# EAGLE design H41R60 (EAGLE 9.2.2)
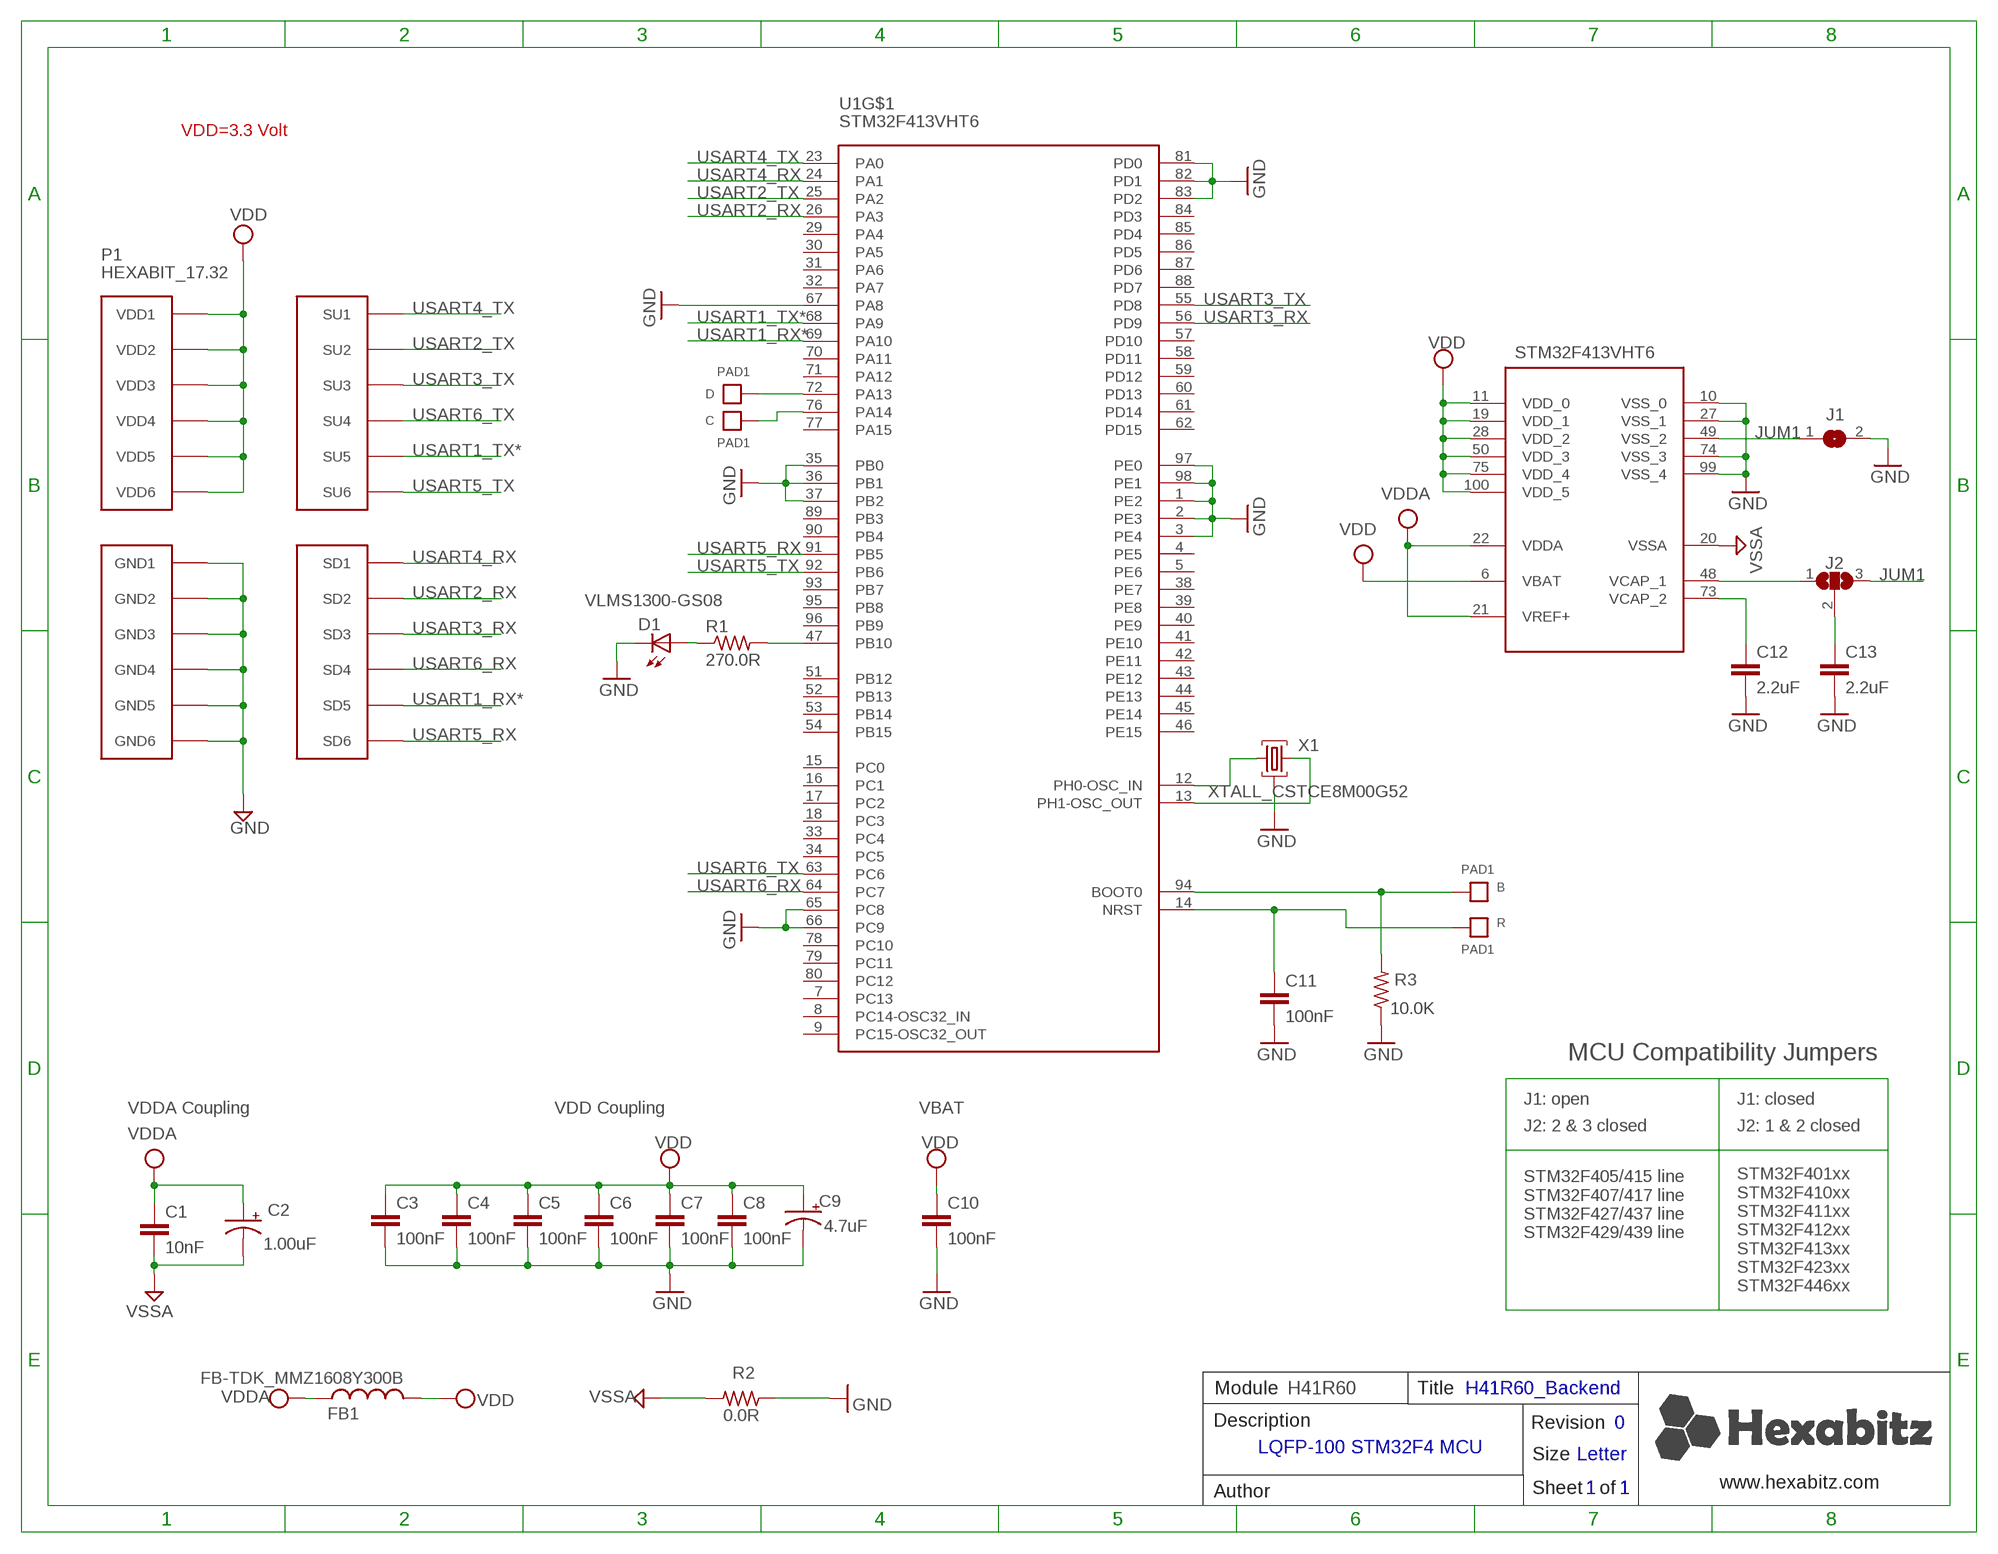
[diagram p0: schematic, sheet 1]

## Parts
B  PAD1  [PAD1]
C  PAD1  [PAD1]
C1  10nF  C-0603  [C-0603]
C2  1.00uF  C-0805-POL  [C-0805-POL]
C3  100nF  C-0603  [C-0603]
C4  100nF  C-0603  [C-0603]
C5  100nF  C-0603  [C-0603]
C6  100nF  C-0603  [C-0603]
C7  100nF  C-0603  [C-0603]
C8  100nF  C-0603  [C-0603]
C9  4.7uF  C-0805-POL  [C-0805-POL]
C10  100nF  C-0603  [C-0603]
C11  100nF  C-0603  [C-0603]
C12  2.2uF  C-0603  [C-0603]
C13  2.2uF  C-0603  [C-0603]
D  PAD1  [PAD1]
D1  VLMS1300-GS08  [VLMS1300-GS08]
FB1  FB-TDK_MMZ1608Y300B  [FB-TDK_MMZ1608Y300B]
J1  SJ  [SJ]
J2  SJ2W  [SJ_2]
P1  HEXABIT_17.32  [HEXABIT_17.32]
R  PAD1  [PAD1]
R1  270.0R  R-0603  [R-0603]
R2  0.0R  R-0603  [R-0603]
R3  10.0K  R-0603  [R-0603]
U1  STM32F413VHT6  [LQFP-100]
X1  XTALL_CSTCE8M00G52  [XTALL_CSTCE8M00G52]

## Nets
B1: B.P$1 B.P$2 R3.2 U1.94(BOOT0)
GND: C3.2 C4.2 C5.2 C6.2 C7.2 C8.2 C9.2(-) C10.2 C11.2 C12.2 C13.2 D1.C J1.2 P1.PAD_PD7(GND1) P1.PAD_PD8(GND2) P1.PAD_PD9(GND3) P1.PAD_PD10(GND4) P1.PAD_PD11(GND5) P1.PAD_PD12(GND6) R2.1 R3.1 U1.1(PE2) U1.2(PE3) U1.3(PE4) U1.10(VSS_0) U1.27(VSS_1) U1.35(PB0) U1.36(PB1) U1.37(PB2) U1.65(PC8) U1.66(PC9) U1.67(PA8) U1.74(VSS_3) U1.81(PD0) U1.82(PD1) U1.83(PD2) U1.97(PE0) U1.98(PE1) U1.99(VSS_4) X1.P$2
JUM1: J1.1 J2.3 U1.49(VSS_2)
N$1: D.P$1 D.P$2 U1.72(PA13)
N$2: C.P$1 C.P$2 U1.76(PA14)
N$3: U1.12(PH0-OSC_IN) X1.P$1
N$4: U1.13(PH1-OSC_OUT) X1.P$3
N$5: C12.1 U1.73(VCAP_2)
N$6: C13.1 J2.2
N$7: R1.2 U1.47(PB10)
N$8: D1.A R1.1
N$9: J2.1 U1.48(VCAP_1)
R1: C11.1 R.P$1 R.P$2 U1.14(NRST)
USART1_RX*: P1.PAD_PD5(SD5) U1.69(PA10)
USART1_TX*: P1.PAD_PU5(SU5) U1.68(PA9)
USART2_RX: P1.PAD_PD2(SD2) U1.26(PA3)
USART2_TX: P1.PAD_PU2(SU2) U1.25(PA2)
USART3_RX: P1.PAD_PD3(SD3) U1.56(PD9)
USART3_TX: P1.PAD_PU3(SU3) U1.55(PD8)
USART4_RX: P1.PAD_PD1(SD1) U1.24(PA1)
USART4_TX: P1.PAD_PU1(SU1) U1.23(PA0)
USART5_RX: P1.PAD_PD6(SD6) U1.91(PB5)
USART5_TX: P1.PAD_PU6(SU6) U1.92(PB6)
USART6_RX: P1.PAD_PD4(SD4) U1.64(PC7)
USART6_TX: P1.PAD_PU4(SU4) U1.63(PC6)
VDD: C3.1 C4.1 C5.1 C6.1 C7.1 C8.1 C9.1(+) C10.1 FB1.2 P1.PAD_PU7(VDD1) P1.PAD_PU8(VDD2) P1.PAD_PU9(VDD3) P1.PAD_PU10(VDD4) P1.PAD_PU11(VDD5) P1.PAD_PU12(VDD6) U1.6(VBAT) U1.11(VDD_0) U1.19(VDD_1) U1.28(VDD_2) U1.50(VDD_3) U1.75(VDD_4) U1.100(VDD_5)
VDDA: C1.1 C2.1(+) FB1.1 U1.21(VREF+) U1.22(VDDA)
VSSA: C1.2 C2.2(-) R2.2 U1.20(VSSA)
Unconnected: U1.4(PE5) U1.5(PE6) U1.7(PC13) U1.8(PC14-OSC32_IN) U1.9(PC15-OSC32_OUT) U1.15(PC0) U1.16(PC1) U1.17(PC2) U1.18(PC3) U1.29(PA4) U1.30(PA5) U1.31(PA6) U1.32(PA7) U1.33(PC4) U1.34(PC5) U1.38(PE7) U1.39(PE8) U1.40(PE9) U1.41(PE10) U1.42(PE11) U1.43(PE12) U1.44(PE13) U1.45(PE14) U1.46(PE15) U1.51(PB12) U1.52(PB13) U1.53(PB14) U1.54(PB15) U1.57(PD10) U1.58(PD11) U1.59(PD12) U1.60(PD13) U1.61(PD14) U1.62(PD15) U1.70(PA11) U1.71(PA12) U1.77(PA15) U1.78(PC10) U1.79(PC11) U1.80(PC12) U1.84(PD3) U1.85(PD4) U1.86(PD5) U1.87(PD6) U1.88(PD7) U1.89(PB3) U1.90(PB4) U1.93(PB7) U1.95(PB8) U1.96(PB9)

## Notes on the sheet
- VDD=3.3 Volt
- STM32F413VHT6
- MCU Compatibility Jumpers
- J1: open | J1: closed
- VDDA Coupling | VDD Coupling | VBAT
- J2: 2 & 3 closed | J2: 1 & 2 closed
- STM32F405/415 line
  STM32F407/417 line
  STM32F427/437 line
  STM32F429/439 line
- STM32F401xx
  STM32F410xx
  STM32F411xx
  STM32F412xx
  STM32F413xx
  STM32F423xx
  STM32F446xx
- Module | H41R60 | Title | H41R60_Backend
- Description | Revision | 0
- LQFP-100 STM32F4 MCU
- Size | Letter
- www.hexabitz.com
- Author | Sheet   of | 1 | 1
- C:/Users/Admin/Desktop/logodraft.bmp

## Library data of the parts
B C D R = Hexabitz:PAD1
C1 = Hexabitz:C-0603: CAP CER 10% X7R 0603; CAPACITANCE: 10nF; MFN: KEMET; MPN: C0603C103K5RACTU; OCTOPART_URL: https://octopart.com/c0603c103k5ractu-kemet-133094?r=sp&s=R_iPBxLnSmGqhkU2rIMFpg; TOLERANCE: 10%; VOLTAGE_RATING: 50V
C2 = Hexabitz:C-0805-POL: Cap Tant Solid SMD 2012; CAPACITANCE: 1.00uF; MFN: Yageo; MPN: CC0805KKX7R7BB105; OCTOPART_URL: https://octopart.com/cc0805kkx7r7bb105-yageo-8376555?r=sp&s=YKl1wwtkROau_X5nniH2ig; TOLERANCE: 10%; VOLTAGE_RATING: 16V
C3-C6 C8 C11 = Hexabitz:C-0603: CAP CER 10% X7R 0603; CAPACITANCE: 100nF; MFN: KEMET; MPN: C0603C104K8RACTU; OCTOPART_URL: https://octopart.com/c0603c104k8ractu-kemet-145075?r=sp&s=9bS9ASSwSEqMCE9KBEQZ0g; TOLERANCE: 10%; VOLTAGE_RATING: 10V
C7 = Hexabitz:C-0603: CAP CER 10% X7R 0603; CAPACITANCE: 100nF; MFN: KEMET; MPN: C0603C104K8RACTU; OCTOPART_URL: https://octopart.com/c0603c104k8ractu-kemet-145075?r=sp&s=9bS9ASSwSEqMCE9KBEQZ0g; TOLERANCE: 10%; VOLTAGE_RATING: 10
C9 = Hexabitz:C-0805-POL: Cap Tant Solid SMD 2012; CAPACITANCE: 4.7uF; MFN: Murata; MPN: GRM21BC81E475KA12L; OCTOPART_URL: https://octopart.com/grm21bc81e475ka12l-murata-10331911?r=sp&s=RY3qZSD8T6mG6TC9CHI5qQ; TOLERANCE: 10%; VOLTAGE_RATING: 25V
C10 = Hexabitz:C-0603: CAP CER 10% X7R 0603; CAPACITANCE: 100nF; MFN: KEMET; MPN: C0603C104K8RACTU; OCTOPART_URL: https://octopart.com/c0603c104k8ractu-kemet-145075?r=sp&s=9bS9ASSwSEqMCE9KBEQZ0g; TOLERANCE: 10V; VOLTAGE_RATING: 10%
C12 C13 = Hexabitz:C-0603: CAP CER 10% X7R 0603; CAPACITANCE: 2.2uF; MFN: TDK Corporation; MPN: C1608X5R1C225K080AB; OCTOPART_URL: https://octopart.com/c1608x5r1c225k080ab-tdk-26013481?r=sp&s=zh0P7eqWSJSPxGSwstsLZg; TOLERANCE: 16V; VOLTAGE_RATING: 20%
D1 = Hexabitz:VLMS1300-GS08: Red 0603 130° Clear 54 mcd 2 V Surface Mount ChipLED ; Octopart Url : http://octopart.com/vlms1300-gs08-vishay-21709201; MFN: Vishay; MPN: VLMS1300-GS08; OCTOPART_URL: https://octopart.com/vlms1300-gs08-vishay-21709201?r=sp&s=_gcP4_q8T1SC6PJQPTQ9yA
FB1 = Hexabitz:FB-TDK_MMZ1608Y300B: Ferrite Beads Multi-Layer 30Ohm 25% 100MHz 1.5A 50mOhm DCR 0603; MFN: TDK; MPN: MMZ1608Y300B; OCTOPART_URL: https://octopart.com/mmz1608y300b-tdk-368280?r=sp&s=cd9_2ZEqQ9q9UNBuQgHAiA
J1 = jumper:SJ: SMD solder JUMPER
J2 = jumper:SJ2W: SMD solder JUMPER
P1 = hexabitz_connectors:HEXABIT_?: Hexabitz Hexagon Module Connector Hexagon side length = 17.32mm.
R1 = Hexabitz:R-0603: Thick Film Resistors - SMD 0603; MFN: Yageo; MPN: RC0603FR-07270RL; OCTOPART_URL: https://octopart.com/search?q=RC0603FR-07270RL&start=0; RESISTANCE: 270.0 Ohm; TOLERANCE: 1%
R2 = Hexabitz:R-0603: Thick Film Resistors - SMD 0603; MFN: Yageo; MPN: RC0603JR-070RL; OCTOPART_URL: https://octopart.com/rc0603jr-070rl-yageo-1241539?r=sp&s=X2NteqRjRNWrnx42Y0aliA; RESISTANCE: 0.0 Ohm
R3 = Hexabitz:R-0603: Thick Film Resistors - SMD 0603; MFN: Yageo; MPN: RC0603JR-0710KL; OCTOPART_URL: https://octopart.com/search?q=RC0603JR-0710KL&start=0; RESISTANCE: 10.0K Ohm; TOLERANCE: 5%
U1 = Hexabitz:STM32F413VH: ARM Cortex-M4 STM32F4 Microcontroller IC 32-Bit 100MHz 1.5MB (1.5M x 8) FLASH 100-LQFP (14x14); MFN: STMicroelectronics; MPN: STM32F413VHT6; OCTOPART_URL: https://octopart.com/stm32f413vht6-stmicroelectronics-75832293?r=sp&s=VtbNrhs6Sfu_OQhO7-rQiQ
X1 = Hexabitz:XTALL_CSTCE8M00G52: MURATA CSTCE8M00G52-R0 RESONATOR, SMD, 8MHZ ; Octopart Url : https://octopart.com/cstce8m00g52-r0-murata-7145559; MFN: Murata; MPN: CSTCE8M00G52Z-R0; OCTOPART_URL: https://octopart.com/cstce8m00g52z-r0-murata-17755941?r=sp&s=JDnNJnrHQhyS8Zk4ofFWXw

## Board
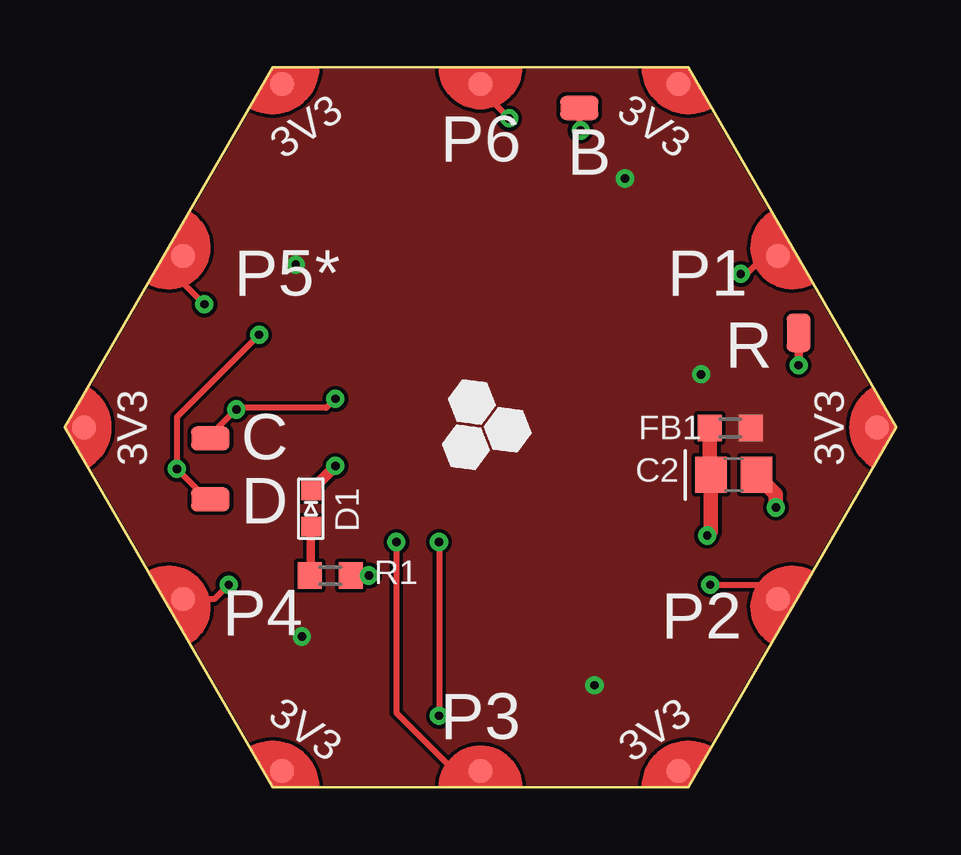
[diagram p1: board, top side]
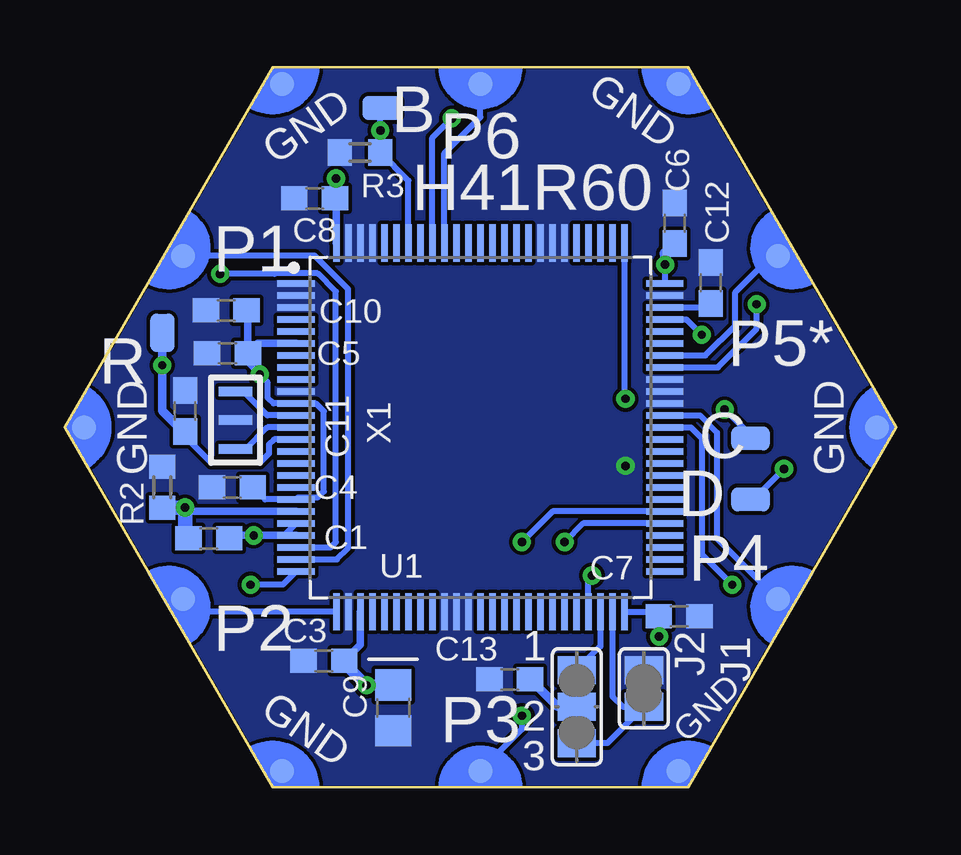
[diagram p2: board, bottom side, seen from below]

Size 34.64 x 30 mm. Coordinates in mm from the lower left corner, seen from the top.
Copper layers (1*16): Top 0.035mm / dielectric 1.5mm / Bottom 0.035mm
Design rules "2_layer": minimum track width 7mil, minimum drill 10mil, track to track 6mil, track to pad 6mil, pad to pad 6mil, via to via 6mil, smd to smd 0mil, copper to edge 1mil, drill to drill 8mil, minimum pad ring 10mil, minimum via ring 8mil, stop-mask expansion 2mil, vias tented up to drill 15mil, thermal gap 10mil

### Footprints (pad centres in the part's own frame; a part is rotated, then mirrored left to right if it is on the bottom)
PAD1 = smd 1.6 x 1: P$1 0,0 | smd 1.6 x 1 bottom: P$2 0,0
C-0603 = smd 1.1 x 1: 1 -0.85,0; 2 0.85,0
C-0805-POL = smd 1.3 x 1.5: 1 -0.95,0; 2 0.95,0
VLMS1300-GS08 = smd 0.8 x 0.8: A 0,0.75; C 0,-0.75
FB-TDK_MMZ1608Y300B = smd 1 x 1.1: 1 -0.85,0; 2 0.85,0
SJ = smd 1.168 x 1.6: 1 -0.762,0; 2 0.762,0
SJ_2 = smd 1.168 x 1.6: 1 -1.524,0; 2 0,0; 3 1.524,0
HEXABIT_17.32 = smd 1 x 1 bottom: PAD_PD1 12.39,7.15; PAD_PD2 12.39,-7.15; PAD_PD3 0,-14.31; PAD_PD4 -12.39,-7.15; PAD_PD5 -12.39,7.15; PAD_PD6 0,14.31; PAD_PD7 8.26,14.31; PAD_PD8 16.52,0; PAD_PD9 8.26,-14.31; PAD_PD10 -8.26,-14.31; PAD_PD11 -16.52,0; PAD_PD12 -8.26,14.31 | smd 1 x 1: PAD_PU1 12.39,7.15; PAD_PU2 12.39,-7.15; PAD_PU3 0,-14.31; PAD_PU4 -12.39,-7.15; PAD_PU5 -12.39,7.15; PAD_PU6 0,14.31; PAD_PU7 8.26,14.31; PAD_PU8 16.52,0; PAD_PU9 8.26,-14.31; PAD_PU10 -8.26,-14.31; PAD_PU11 -16.52,0; PAD_PU12 -8.26,14.31
R-0603 = smd 1 x 1.1: 1 -0.85,0; 2 0.85,0
LQFP-100 = smd 1.559 x 0.28: 1 -7.678,6; 2 -7.678,5.5; 3 -7.678,5; 4 -7.678,4.5; 5 -7.678,4; 6 -7.678,3.5; 7 -7.678,3; 8 -7.678,2.5; 9 -7.678,2; 10 -7.678,1.5; 11 -7.678,1; 12 -7.678,0.5; 13 -7.678,0; 14 -7.678,-0.5; 15 -7.678,-1; 16 -7.678,-1.5; 17 -7.678,-2; 18 -7.678,-2.5; 19 -7.678,-3; 20 -7.678,-3.5; 21 -7.678,-4; 22 -7.678,-4.5; 23 -7.678,-5; 24 -7.678,-5.5; 25 -7.678,-6; 51 7.678,-6; 52 7.678,-5.5; 53 7.678,-5; 54 7.678,-4.5; 55 7.678,-4; 56 7.678,-3.5; 57 7.678,-3; 58 7.678,-2.5; 59 7.678,-2; 60 7.678,-1.5; 61 7.678,-1; 62 7.678,-0.5; 63 7.678,0; 64 7.678,0.5; 65 7.678,1; 66 7.678,1.5; 67 7.678,2; 68 7.678,2.5; 69 7.678,3; 70 7.678,3.5; 71 7.678,4; 72 7.678,4.5; 73 7.678,5; 74 7.678,5.5; 75 7.678,6 | smd 0.28 x 1.559: 26 -6,-7.678; 27 -5.5,-7.678; 28 -5,-7.678; 29 -4.5,-7.678; 30 -4,-7.678; 31 -3.5,-7.678; 32 -3,-7.678; 33 -2.5,-7.678; 34 -2,-7.678; 35 -1.5,-7.678; 36 -1,-7.678; 37 -0.5,-7.678; 38 0,-7.678; 39 0.5,-7.678; 40 1,-7.678; 41 1.5,-7.678; 42 2,-7.678; 43 2.5,-7.678; 44 3,-7.678; 45 3.5,-7.678; 46 4,-7.678; 47 4.5,-7.678; 48 5,-7.678; 49 5.5,-7.678; 50 6,-7.678; 76 6,7.678; 77 5.5,7.678; 78 5,7.678; 79 4.5,7.678; 80 4,7.678; 81 3.5,7.678; 82 3,7.678; 83 2.5,7.678; 84 2,7.678; 85 1.5,7.678; 86 1,7.678; 87 0.5,7.678; 88 0,7.678; 89 -0.5,7.678; 90 -1,7.678; 91 -1.5,7.678; 92 -2,7.678; 93 -2.5,7.678; 94 -3,7.678; 95 -3.5,7.678; 96 -4,7.678; 97 -4.5,7.678; 98 -5,7.678; 99 -5.5,7.678; 100 -6,7.678
XTALL_CSTCE8M00G52 = smd 1.4 x 0.4: P$1 0,1.2; P$2 0,0; P$3 0,-1.2

### Placement (x,y rotation side)
B  21.43,28.31 0 top
C  6.07,14.54 0 top
C1  28.64,10.38 180 bottom
C2  27.87,13.03 0 top
C3  23.85,5.27 180 bottom
C4  27.66,12.51 180 bottom
C5  27.91,19.88 180 bottom
C6  9.22,23.51 90 bottom
C7  9.04,7.13 0 bottom
C8  24.23,24.55 180 bottom
C9  20.95,3.32 270 bottom
C10  27.86,18.1 180 bottom
C11  29.63,15.69 90 bottom
C12  7.72,21.02 90 bottom
C13  16.1,4.51 180 bottom
D  6.07,12 0 top
D1  10.26,11.62 180 top
FB1  27.73,14.97 0 top
J1  10.51,4.13 90 bottom
J2  13.31,3.37 270 bottom
P1  17.32,15 0 top
R  30.58,18.94 90 top
R1  11.06,8.83 0 top
R2  30.58,12.51 270 bottom
R3  22.34,26.46 0 bottom
U1  17.32,15 0 bottom
X1  27.53,15.3 0 bottom

### Tracks (layer width: path | path; a pad name or v marks a point on that pad's centre or on a via)
B1  (via drill 0.35)
  Top 0.254: B.P$2 21.43,27.43 v21.49,27.37
  Bottom 0.254: U1.94 20.32,25.28 R3.2 v21.49,27.37 21.49,28.25 B.P$2
GND  (via drill 0.35)
  Top 0.457: D1.C 11.27,13.39 v11.27,13.4
  pour Bottom (no thermals): 8.66,0 25.98,0 34.64,15 25.98,30 8.66,30 0,15
JUM1
  Bottom 0.254: U1.49 11.82,6.45 11.82,3.78 11.4,3.37 J1.1 12.04,1.84 J2.3
N$1  (via drill 0.35)
  Top 0.254: v8.1,18.86 4.67,15.43 v4.67,13.27 5.94,12 D.P$2
  Bottom 0.254: U1.72 8.74,19.5 v8.1,18.86 | D.P$2 5.94,12 v4.67,13.27
N$2  (via drill 0.35)
  Top 0.254: v11.27,16.19 10.89,15.81 7.21,15.81 v7.15,15.75 6.07,14.67 C.P$2
  Bottom 0.254: U1.76 11.32,16.24 v11.27,16.19 | C.P$2 6.07,14.67 v7.15,15.75
N$3
  Bottom 0.254: U1.12 26.2,15.5 27.21,16.5
  Bottom 0.305: 27.21,16.5 X1.P$1
N$4
  Bottom 0.254: U1.13 26.19,15 27.09,14.1 X1.P$3
N$5
  Bottom 0.254: U1.73 7.89,20 C12.1
N$6
  Bottom 0.356: C13.1 14.11,3.37 J2.2
N$7  (via drill 0.35)
  Top 0.254: v12.67,8.83 R1.2
  Bottom 0.254: U1.47 12.82,8.68 v12.67,8.83
N$8
  Top 0.356: D1.A 10.26,8.88 R1.1
N$9
  Bottom 0.254: U1.48 12.32,5.88 J2.1
R1  (via drill 0.35)
  Top 0.356: R.P$2 v30.58,17.59
  Bottom 0.254: U1.14 25.92,14.5 26.13,14.29 26.13,13.91 26.51,13.53 28.55,13.53 29.63,14.61 C11.1
  Bottom 0.356: R.P$2 v30.58,17.59 30.58,15.69 29.73,14.84 C11.1
USART1_RX*
  Bottom 0.254: U1.69 7.94,18 6.7,19.24 6.7,20.64 5.19,22.15 P1.PAD_PD5
USART1_TX*  (via drill 0.35)
  Top 0.254: v5.81,20.13 4.93,21.01 P1.PAD_PU5
  Bottom 0.254: U1.68 7.43,17.5 5.81,19.11 v5.81,20.13
USART2_RX
  Bottom 0.254: U1.26 29.18,7.32 P1.PAD_PD2
USART2_TX  (via drill 0.35)
  Top 0.254: v26.9,8.45 29.11,8.45 P1.PAD_PU2
  Bottom 0.254: U1.25 25.55,8.45 v26.9,8.45
USART3_RX  (via drill 0.35)
  Top 0.254: v15.59,10.22 v15.59,2.99
  Bottom 0.254: U1.56 14.32,11.5 v15.59,10.22 | v15.59,2.99 15.59,2.42 P1.PAD_PD3
USART3_TX  (via drill 0.35)
  Top 0.254: v13.81,10.22 13.81,3.11 16.24,0.69 P1.PAD_PU3
  Bottom 0.254: U1.55 13.04,11 v13.81,10.22
USART4_RX
  Bottom 0.254: U1.24 23.3,9.5 22.83,9.97 22.83,20.77 24.23,22.16 29.7,22.16 P1.PAD_PD1
USART4_TX  (via drill 0.35)
  Top 0.254: v28.17,21.4 28.42,21.4 29.17,22.15 P1.PAD_PU1
  Bottom 0.254: U1.23 23.56,10 23.34,10.22 23.34,20.66 24.1,21.42 25.89,21.42 25.91,21.4 v28.17,21.4
USART5_RX
  Bottom 0.254: U1.91 18.82,26.43 17.32,27.93 P1.PAD_PD6
USART5_TX  (via drill 0.35)
  Top 0.254: v18.51,27.88 17.32,29.07 P1.PAD_PU6
  Bottom 0.254: U1.92 19.32,27.07 v18.51,27.88
USART6_RX
  Bottom 0.254: U1.64 8.17,15.5 7.46,14.8 7.46,10.38 P1.PAD_PD4
USART6_TX  (via drill 0.35)
  Top 0.254: v6.83,8.45 6.23,7.85 P1.PAD_PU4
  Bottom 0.254: U1.63 8.56,15 8.1,14.54 8.1,9.72 v6.83,8.45
VDD  (via drill 0.35)
  Bottom 0.254: U1.50 9.91,7.32 C7.1 | C10.1 27.01,17.71 v26.51,17.21 26.18,16.88 26.18,16.24 25.94,16 U1.11 24.18,16 23.85,15.66 23.85,12.34 24.1,12.08 24.92,12.08 U1.19 26.3,12 C4.1 | v9.62,21.78 9.64,21.76 U1.75
  Bottom 0.305: U1.28 22.32,5.95 C3.1 | U1.100 23.32,24.45 C8.1 | U1.6 26.61,18.5 C10.1 27.01,19.83 C5.1
  Bottom 0.457: C7.1 v9.89,6.3 v9.88,6.29 | C8.1 23.38,25.34 v23.34,25.37 | C9.1 v22.06,4.27 v22.07,4.26 23,5.18 C3.1 | C6.1 9.62,22.25 v9.62,21.78
  pour Top (no thermals): 8.66,0 25.98,0 34.64,15 25.98,30 8.66,30 0,15
VDDA  (via drill 0.35)
  Top 0.61: FB1.1 26.88,13.07 C2.1 26.92,10.66 v26.77,10.5
  Bottom 0.254: U1.21 25.5,10.5
  Bottom 0.305: U1.22 25.5,10.5 v26.77,10.5 27.67,10.5 C1.1
VSSA  (via drill 0.35)
  Top 0.61: v29.63,11.66 29.63,12.22 C2.2
  Bottom 0.305: U1.20 29.49,11.5 C1.2
  Bottom 0.61: C1.2 29.63,10.52 v29.63,11.66 R2.2

### Text on the board
tPlace: 3V3 | P6 | 3V3 | P5* | P1 | 3V3 | 3V3 | P4 | P2 | P3 | 3V3 | 3V3
bPlace: GND | P6 | GND | H41R60 | P1 | P5* | GND | GND | P4 | P2 | GND | P3 | GND
bNames: B | R | D | C | 1 | 2 | 3